# EAGLE design Gloves PCB (EAGLE 6.6.0)
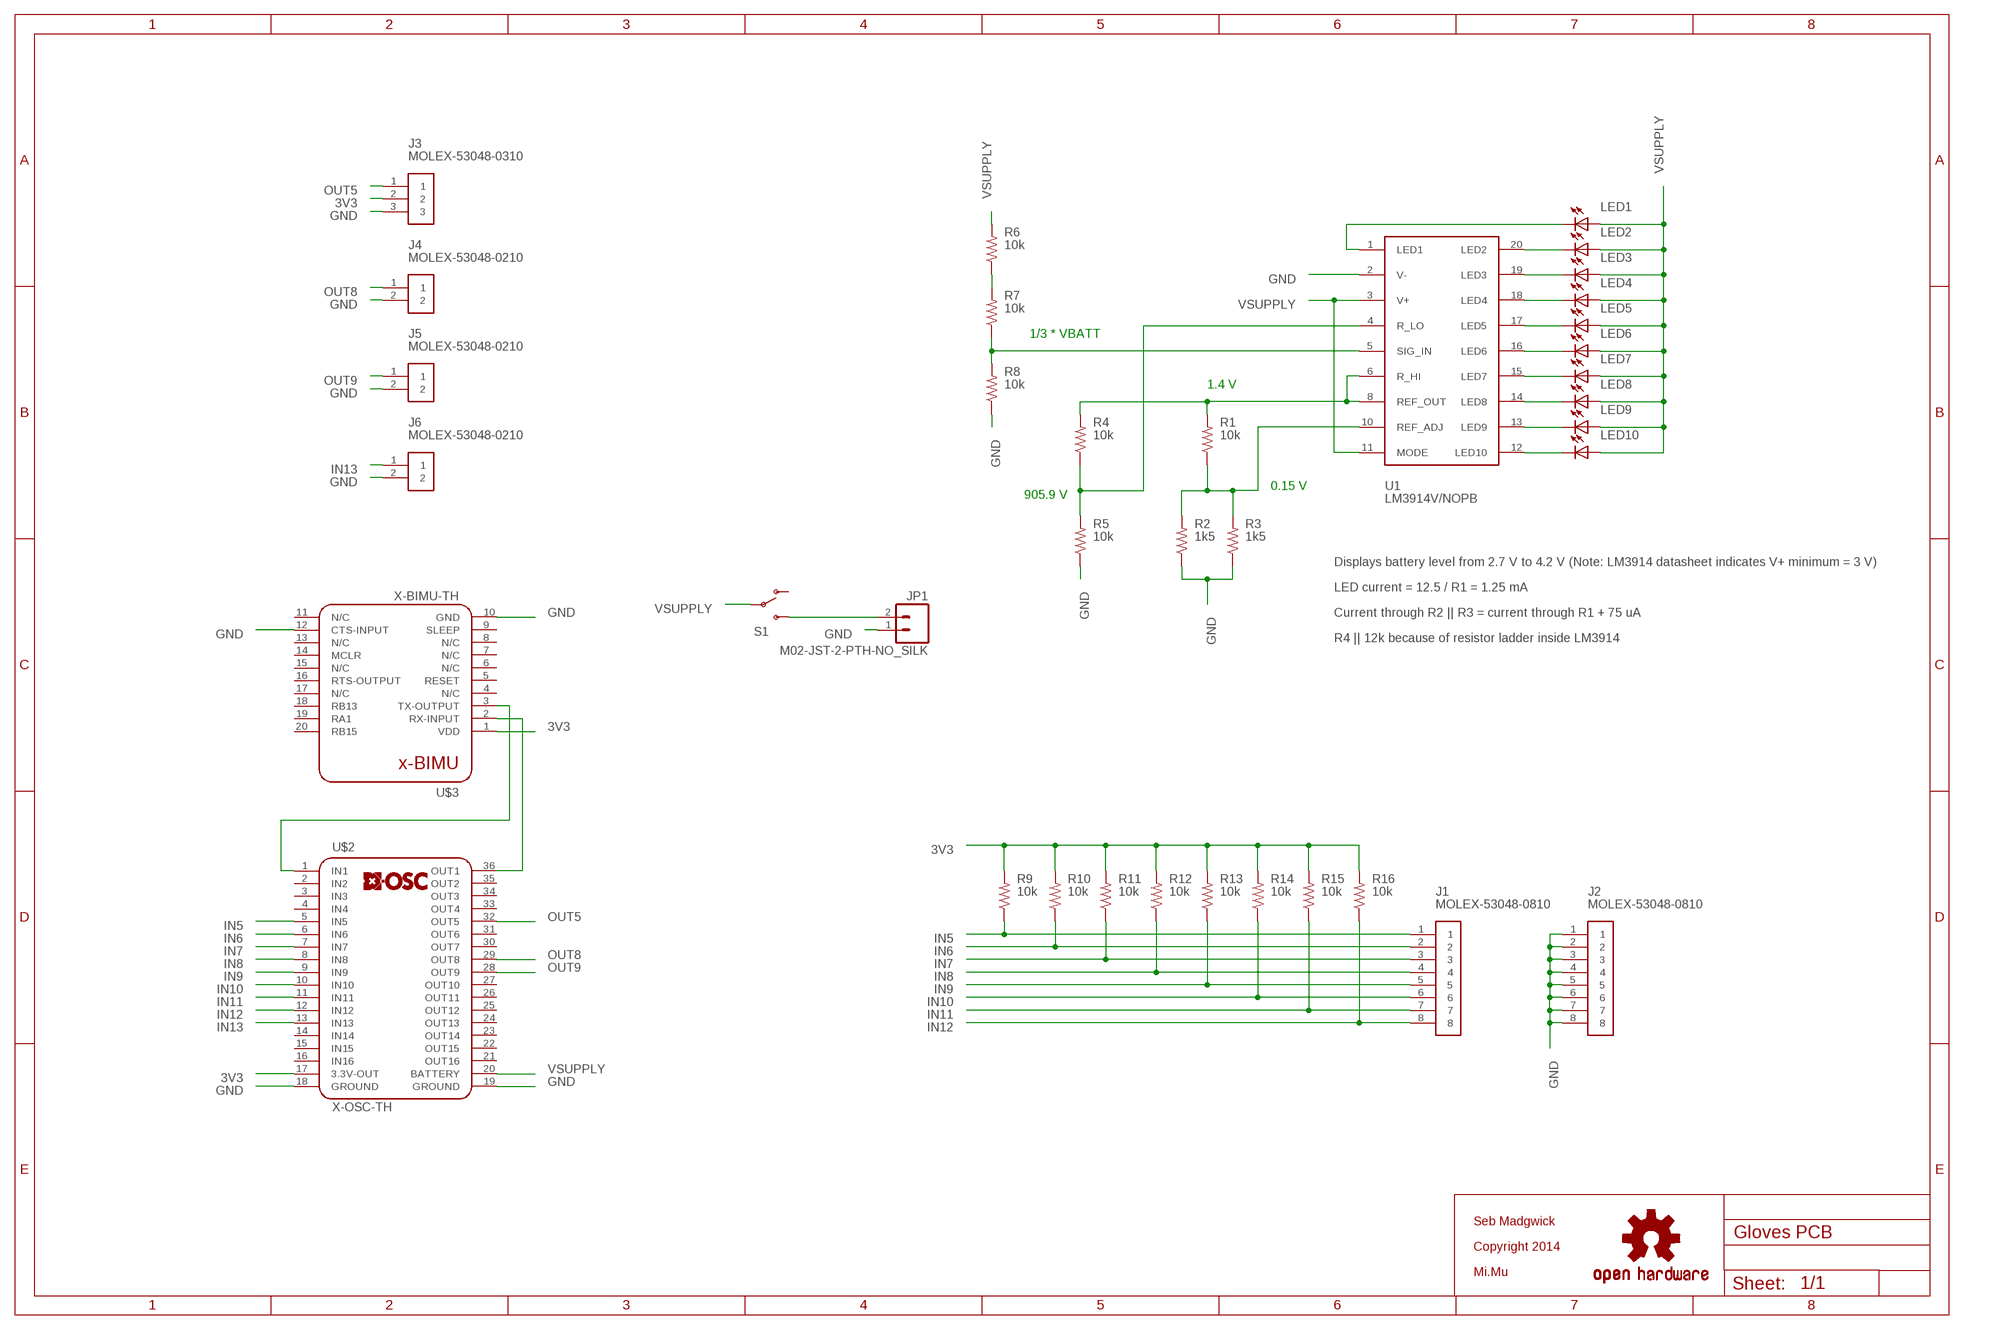
[diagram p0: schematic, sheet 1]

## Parts
J1  MOLEX-53048-0810  [MOLEX-53048-0810]
J2  MOLEX-53048-0810  [MOLEX-53048-0810]
J3  MOLEX-53048-0310  [MOLEX-53048-0310]
J4  MOLEX-53048-0210  [MOLEX-53048-0210]
J5  MOLEX-53048-0210  [MOLEX-53048-0210]
J6  MOLEX-53048-0210  [MOLEX-53048-0210]
JP1  M02-JST-2-PTH-NO_SILK  [JST-2-PTH-NS]
LED1  LEDCHIPLED_1206  [CHIPLED_1206]
LED2  LEDCHIPLED_1206  [CHIPLED_1206]
LED3  LEDCHIPLED_1206  [CHIPLED_1206]
LED4  LEDCHIPLED_1206  [CHIPLED_1206]
LED5  LEDCHIPLED_1206  [CHIPLED_1206]
LED6  LEDCHIPLED_1206  [CHIPLED_1206]
LED7  LEDCHIPLED_1206  [CHIPLED_1206]
LED8  LEDCHIPLED_1206  [CHIPLED_1206]
LED9  LEDCHIPLED_1206  [CHIPLED_1206]
LED10  LEDCHIPLED_1206  [CHIPLED_1206]
R1  10k  RESISTOR0805-RES  [0805]
R2  1k5  RESISTOR0805-RES  [0805]
R3  1k5  RESISTOR0805-RES  [0805]
R4  10k  RESISTOR0805-RES  [0805]
R5  10k  RESISTOR0805-RES  [0805]
R6  10k  RESISTOR0805-RES  [0805]
R7  10k  RESISTOR0805-RES  [0805]
R8  10k  RESISTOR0805-RES  [0805]
R9  10k  RESISTOR0805-RES  [0805]
R10  10k  RESISTOR0805-RES  [0805]
R11  10k  RESISTOR0805-RES  [0805]
R12  10k  RESISTOR0805-RES  [0805]
R13  10k  RESISTOR0805-RES  [0805]
R14  10k  RESISTOR0805-RES  [0805]
R15  10k  RESISTOR0805-RES  [0805]
R16  10k  RESISTOR0805-RES  [0805]
S1  SWITCH-DPST  [WURTH-ELEKTRONIK-450301014042]
U1  LM3914V/NOPB  LM3914PLCC  [PLCC-20]
U$1  OSHW-LOGOS  [OSHW-LOGO-S]
U$2  X-OSC-TH  [X-OSC_TH]
U$3  X-BIMU-TH  [X-BIMU_TH]

## Nets
3V3: J3.2 R9.2 R10.2 R11.2 R12.2 R13.2 R14.2 R15.2 R16.2 U$2.17(3.3V-OUT) U$3.1(VDD)
GND: J2.1 J2.2 J2.3 J2.4 J2.5 J2.6 J2.7 J2.8 J3.3 J4.2 J5.2 J6.2 JP1.1 R2.1 R3.1 R5.1 R8.1 U1.2(V-) U$2.18(GROUND) U$2.19(GROUND) U$3.10(GND) U$3.12(CTS-INPUT)
IN5: J1.1 R9.1 U$2.5(IN5)
IN6: J1.2 R10.1 U$2.6(IN6)
IN7: J1.3 R11.1 U$2.7(IN7)
IN8: J1.4 R12.1 U$2.8(IN8)
IN9: J1.5 R13.1 U$2.9(IN9)
IN10: J1.6 R14.1 U$2.10(IN10)
IN11: J1.7 R15.1 U$2.11(IN11)
IN12: J1.8 R16.1 U$2.12(IN12)
IN13: J6.1 U$2.13(IN13)
N$1: U$2.1(IN1) U$3.3(TX-OUTPUT)
N$2: R4.1 R5.2 U1.4(R_LO)
N$3: JP1.2 S1.3
N$4: R7.1 R8.2 U1.5(SIG_IN)
N$5: R6.1 R7.2
N$6: R1.1 R2.2 R3.2 U1.10(REF_ADJ)
N$7: LED10.C U1.12(LED10)
N$8: LED9.C U1.13(LED9)
N$9: LED8.C U1.14(LED8)
N$10: LED7.C U1.15(LED7)
N$11: LED6.C U1.16(LED6)
N$12: LED5.C U1.17(LED5)
N$13: LED4.C U1.18(LED4)
N$14: LED3.C U1.19(LED3)
N$15: LED2.C U1.20(LED2)
N$16: LED1.C U1.1(LED1)
N$21: U$2.36(OUT1) U$3.2(RX-INPUT)
OUT5: J3.1 U$2.32(OUT5)
OUT8: J4.1 U$2.29(OUT8)
OUT9: J5.1 U$2.28(OUT9)
REF_OUT: R1.2 R4.2 U1.6(R_HI) U1.8(REF_OUT)
VSUPPLY: LED1.A LED2.A LED3.A LED4.A LED5.A LED6.A LED7.A LED8.A LED9.A LED10.A R6.2 S1.2 U1.3(V+) U1.11(MODE) U$2.20(BATTERY)
Unconnected: S1.1 U$2.2(IN2) U$2.3(IN3) U$2.4(IN4) U$2.14(IN14) U$2.15(IN15) U$2.16(IN16) U$2.21(OUT16) U$2.22(OUT15) U$2.23(OUT14) U$2.24(OUT13) U$2.25(OUT12) U$2.26(OUT11) U$2.27(OUT10) U$2.30(OUT7) U$2.31(OUT6) U$2.33(OUT4) U$2.34(OUT3) U$2.35(OUT2) U$3.4(N/C) U$3.5(RESET) U$3.6(N/C) U$3.7(N/C) U$3.8(N/C) U$3.9(SLEEP) U$3.11(N/C) U$3.13(N/C) U$3.14(MCLR) U$3.15(N/C) U$3.16(RTS-OUTPUT) U$3.17(N/C) U$3.18(RB13) U$3.19(RA1) U$3.20(RB15)

## Notes on the sheet
- 1/3 * VBATT
- 1.4 V
- 905.9 V | 0.15 V
- Displays battery level from 2.7 V to 4.2 V (Note: LM3914 datasheet indicates V+ minimum = 3 V)
- LED current = 12.5 / R1 = 1.25 mA
- Current through R2 || R3 = current through R1 + 75 uA
- R4 || 12k because of resistor ladder inside LM3914
- Seb Madgwick
- Copyright 2014
- Mi.Mu

## Library data of the parts
J1 J2 = x-io:MOLEX-53048-0810
J3 = x-io:MOLEX-53048-0310
J4-J6 = x-io:MOLEX-53048-0210
JP1 = SparkFun-Connectors:M02: Standard 2-pin 0.1" header. Use with - straight break away headers ( PRT-00116) - right angle break away headers (PRT-00553) - swiss pins (PRT-00743) - machine pins (PRT-00117) - female headers (PRT-00115) Molex polarized connector foot print use with: PRT-08233 with associated crimp pins and housings. 2.54_SCREWTERM for use with PRT-10571. 3.5mm Screw Terminal footprints for PRT-08084 5mm Screw Terminal footprints for use with PRT-08433
LED1-LED10 = led:LED: LED OSRAM: - CHIPLED LG R971, LG N971, LY N971, LG Q971, LY Q971, LO R971, LY R971 LH N974, LH R974 LS Q976, LO Q976, LY Q976 LO Q996 - Hyper CHIPLED LW Q18S LB Q993, LB Q99A, LB R99A - SideLED LS A670, LO A670, LY A670, LG A670, LP A670 LB A673, LV A673, LT A673, LW A673 LH A674 LY A675 LS A676, LA A676, LO A676, LY A676, LW A676 LS A679, LY A679, LG A679 - Hyper Micro SIDELED® LS Y876, LA Y876, LO Y876, LY Y876 LT Y87S - SmartLED LW L88C, LW L88S LB L89C, LB L89S, LG L890 LS L89K, LO L89K, LY L89K LS L896, LA L896, LO L896, LY L896 - TOPLED LS T670, LO T670, LY T670, LG T670, LP T670 LSG T670, LSP T670, LSY T670, LOP T670, LYG T670 LG T671, LOG T671, LSG T671 LB T673, LV T673, LT T673, LW T673 LH T674 LS T676, LA T676, LO T676, LY T676, LB T676, LH T676, LSB T676, LW T676 LB T67C, LV T67C, LT T67C, LS T67K, LO T67K, LY T67K, LW E67C LS E67B, LA E67B, LO E67B, LY E67B, LB E67C, LV E67C, LT E67C LW T67C LS T679, LY T679, LG T679 LS T770, LO T770, LY T770, LG T770, LP T770 LB T773, LV T773, LT T773, LW T773 LH T774 LS E675, LA E675, LY E675, LS T675 LS T776, LA T776, LO T776, LY T776, LB T776 LHGB T686 LT T68C, LB T68C - Hyper Mini TOPLED® LB M676 - Mini TOPLED Santana® LG M470 LS M47K, LO M47K, LY M47K Source: http://www.osram.convergy.de - LUMILED® LXK2-PW12-R00, LXK2-PW12-S00, LXK2-PW14-U00, LXK2-PW14-V00 LXK2-PM12-R00, LXK2-PM12-S00, LXK2-PM14-U00 LXK2-PE12-Q00, LXK2-PE12-R00, LXK2-PE12-S00, LXK2-PE14-T00, LXK2-PE14-U00 LXK2-PB12-K00, LXK2-PB12-L00, LXK2-PB12-M00, LXK2-PB14-N00, LXK2-PB14-P00, LXK2-PB14-Q00 LXK2-PR12-L00, LXK2-PR12-M00, LXK2-PR14-Q00, LXK2-PR14-R00 LXK2-PD12-Q00, LXK2-PD12-R00, LXK2-PD12-S00 LXK2-PH12-R00, LXK2-PH12-S00 LXK2-PL12-P00, LXK2-PL12-Q00, LXK2-PL12-R00 Source: www.luxeon.com
R1-R16 = SparkFun-Passives:RESISTOR: Resistor Basic schematic elements and footprints for 0603, 1206, and PTH resistors.
S1 = x-io:SWITCH-DPST: SPST Switch Simple slide switch. Spark Fun Electronics SKU : COM-00102
U1 = x-io:LM3914
U$1 = SparkFun_08_2011:OSHW-LOGO: Open Source Hardware Logo This logo indicates the piece of hardware it is found on incorporates a OSHW license and/or adheres to the definition of open source hardware found here: http://freedomdefined.org/OSHW
U$2 = x-io-EAGLE-Library:X-OSC: x-OSC <http://www.x-io.co.uk/products/x-osc/> foot print for SMD or through-hole headers.
U$3 = x-io-EAGLE-Library:X-BIMU: x-BIMU <http://www.x-io.co.uk/products/x-bimu/> foot print for SMD or through-hole headers.

## Board
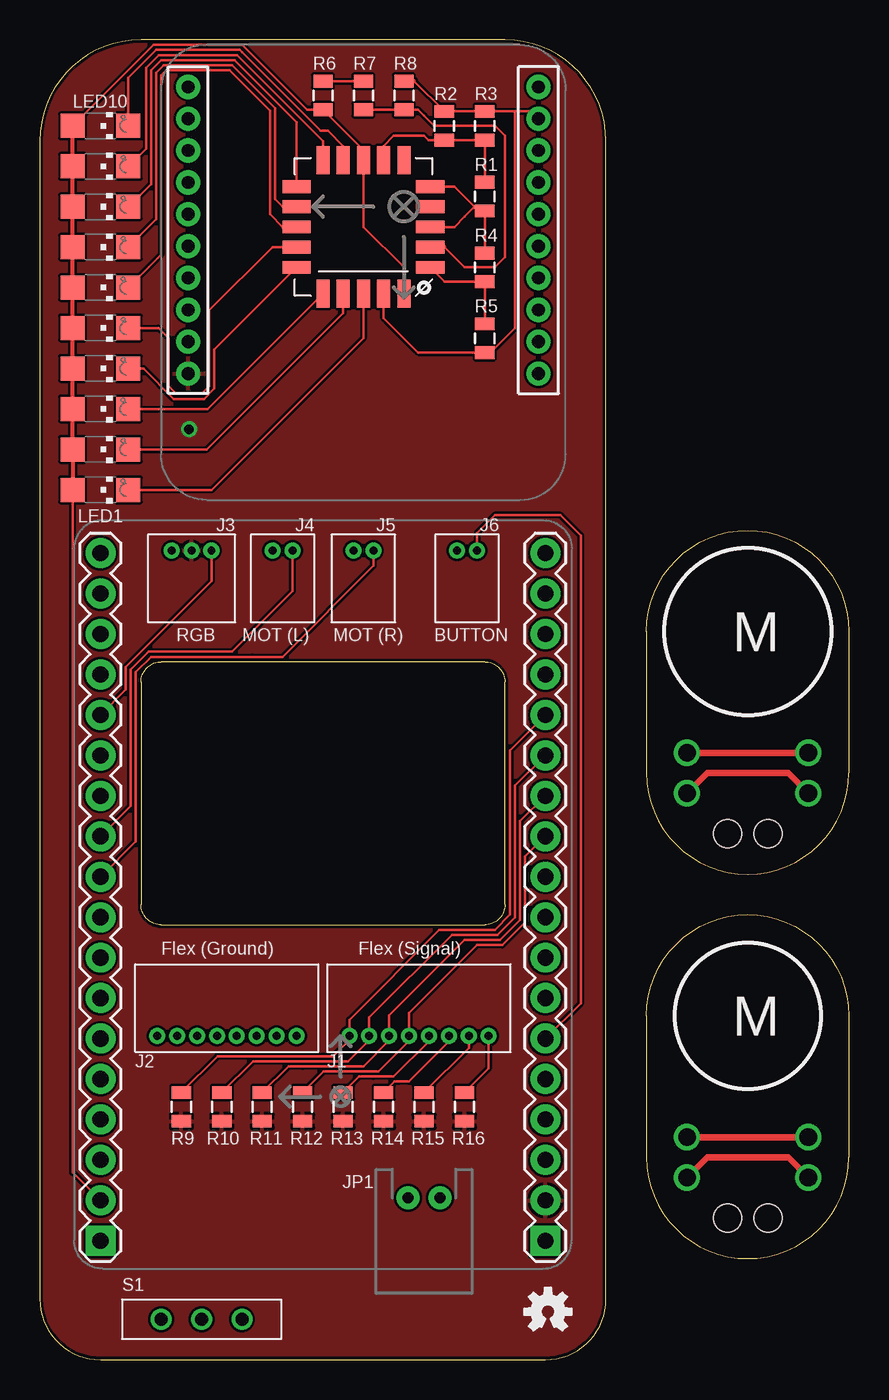
[diagram p1: board, top side]
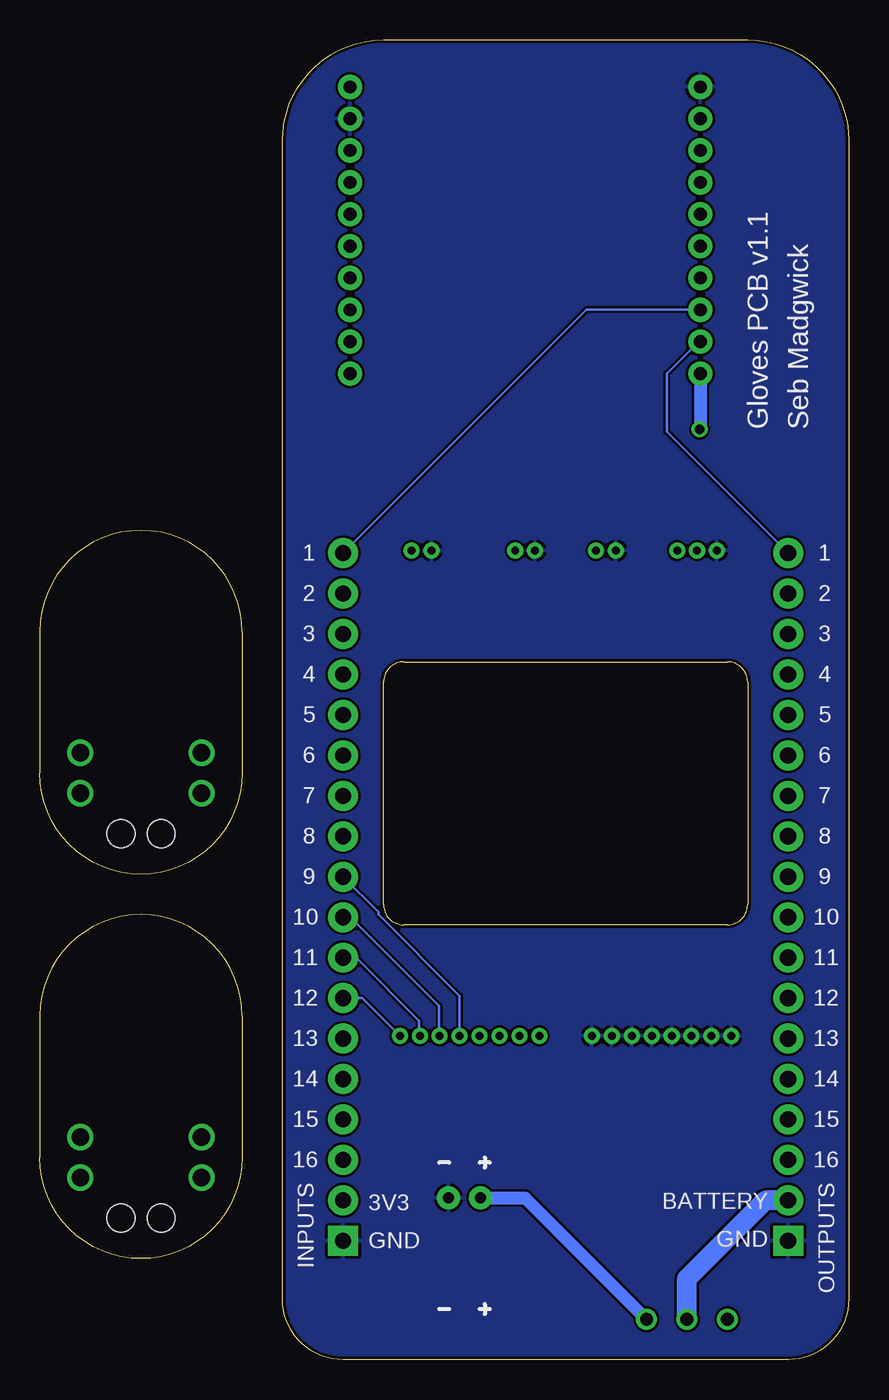
[diagram p2: board, bottom side, seen from below]

Size 50.8 x 82.87 mm. Coordinates in mm from the lower left corner, seen from the top.
Outline: 3.81,0 31.75,0 arc90 35.56,3.81 35.56,76.52 arc90 29.21,82.87 6.35,82.87 arc90 0,76.52 0,3.81 arc90 3.81,0
Outline: 7.62,27.3 27.94,27.3 arc90 29.21,28.57 29.21,42.55 arc90 27.94,43.81 7.62,43.81 arc90 6.35,42.55 6.35,28.57 arc90 7.62,27.3
Outline: 38.1,45.72 arc-180 50.8,45.72 50.8,36.83 arc-180 38.1,36.83 38.1,45.72
Outline: 38.1,21.59 arc-180 50.8,21.59 50.8,12.7 arc-180 38.1,12.7 38.1,21.59
Copper layers (1*16): Top 0.035mm / dielectric 1.5mm / Bottom 0.035mm
Design rules "default *": minimum track width 0.15mm, minimum drill 0.3mm, track to track 0.15mm, track to pad 0.15mm, pad to pad 0.15mm, via to via 0.15mm, smd to smd 0.15mm, copper to edge 0.2mm, drill to drill 0.15mm, minimum pad ring 10mil, minimum via ring 8mil, stop-mask expansion 4mil, vias tented up to drill 1mm, thermal gap 0.195mm
Holes 1.75 mm at 45.72,33.02 43.18,33.02 45.72,8.89 43.18,8.89

### Footprints (pad centres in the part's own frame; a part is rotated, then mirrored left to right if it is on the bottom)
MOLEX-53048-0810 = drill 0.5: 1 -4.375,0; 2 -3.125,0; 3 -1.875,0; 4 -0.625,0; 5 0.625,0; 6 1.875,0; 7 3.125,0; 8 4.375,0
MOLEX-53048-0310 = drill 0.5: 1 -1.25,0; 2 0,0; 3 1.25,0
MOLEX-53048-0210 = drill 0.5: 1 -0.625,0; 2 0.625,0
JST-2-PTH-NS = drill 0.7 pad 1.448: 1 -1,0; 2 1,0
CHIPLED_1206 = smd 1.5 x 1.5: A 0,-1.75; C 0,1.75
0805 = smd 0.8 x 1.2: 1 -0.9,0; 2 0.9,0
WURTH-ELEKTRONIK-450301014042 = drill 0.8: 1 -2.54,0; 2 0,0; 3 2.54,0
PLCC-20 = smd 0.813 x 1.778: 1 0,4.191; 2 -1.27,4.191; 3 -2.54,4.191; 9 -2.54,-4.191; 10 -1.27,-4.191; 11 0,-4.191; 12 1.27,-4.191; 13 2.54,-4.191; 19 2.54,4.191; 20 1.27,4.191 | smd 1.778 x 0.813: 4 -4.191,2.54; 5 -4.191,1.27; 6 -4.191,0; 7 -4.191,-1.27; 8 -4.191,-2.54; 14 4.191,-2.54; 15 4.191,-1.27; 16 4.191,0; 17 4.191,1.27; 18 4.191,2.54
X-OSC_TH = drill 1.016 pad 1.88: 1 13.97,21.431; 2 13.97,18.891; 3 13.97,16.351; 4 13.97,13.811; 5 13.97,11.271; 6 13.97,8.731; 7 13.97,6.191; 8 13.97,3.651; 9 13.97,1.111; 10 13.97,-1.429; 11 13.97,-3.969; 12 13.97,-6.509; 13 13.97,-9.049; 14 13.97,-11.589; 15 13.97,-14.129; 16 13.97,-16.669; 17 13.97,-19.209; 20 -13.97,-19.209; 21 -13.97,-16.669; 22 -13.97,-14.129; 23 -13.97,-11.589; 24 -13.97,-9.049; 25 -13.97,-6.509; 26 -13.97,-3.969; 27 -13.97,-1.429; 28 -13.97,1.111; 29 -13.97,3.651; 30 -13.97,6.191; 31 -13.97,8.731; 32 -13.97,11.271; 33 -13.97,13.811; 34 -13.97,16.351; 35 -13.97,18.891; 36 -13.97,21.431 | drill 1.016 pad 1.88 square: 18 13.97,-21.749; 19 -13.97,-21.749
X-BIMU_TH = drill 0.8 pad 1.524: 1 11,7.935; 2 11,5.935; 3 11,3.935; 4 11,1.935; 5 11,-0.065; 6 11,-2.065; 7 11,-4.065; 8 11,-6.065; 9 11,-8.065; 10 11,-10.065; 11 -11,-10.065; 12 -11,-8.065; 13 -11,-6.065; 14 -11,-4.065; 15 -11,-2.065; 16 -11,-0.065; 17 -11,1.935; 18 -11,3.935; 19 -11,5.935; 20 -11,7.935

### Placement (x,y rotation side)
J1  23.81,20.32 0 top
J2  11.75,20.32 0 top
J3  9.53,50.8 180 top
J4  15.24,50.8 180 top
J5  20.32,50.8 180 top
J6  26.83,50.8 180 top
JP1  24.13,10.16 180 top
LED1  3.81,54.61 270 top
LED2  3.81,57.15 270 top
LED3  3.81,59.69 270 top
LED4  3.81,62.23 270 top
LED5  3.81,64.77 270 top
LED6  3.81,67.31 270 top
LED7  3.81,69.85 270 top
LED8  3.81,72.39 270 top
LED9  3.81,74.93 270 top
LED10  3.81,77.47 270 top
R1  27.94,73.03 270 top
R2  25.4,77.47 270 top
R3  27.94,77.47 270 top
R4  27.94,68.58 90 top
R5  27.94,64.14 90 top
R6  17.78,79.38 270 top
R7  20.32,79.38 90 top
R8  22.86,79.38 270 top
R9  8.89,15.88 270 top
R10  11.43,15.88 270 top
R11  13.97,15.88 270 top
R12  16.51,15.88 270 top
R13  19.05,15.88 270 top
R14  21.59,15.88 270 top
R15  24.13,15.88 270 top
R16  26.67,15.88 270 top
S1  10.16,2.54 0 top
U1  20.32,71.12 180 top
U$1  31.91,3.02 0 top
U$2  17.78,29.21 0 top
U$3  20.32,69.85 180 top

### Tracks (layer width: path | path; a pad name or v marks a point on that pad's centre or on a via)
3V3  (via drill 0.6)
  Bottom 0.813: U$3.1 9.32,58.47 v9.37,58.42
  pour Top: 0,82.87 35.56,82.87 35.56,0 0,0
GND
  Top 0.152: U1.2 21.59,65.41 23.76,63.23 R5.1 28.31,63.23 29.84,64.77 29.84,78.37 | 23.5,80.28 R2.1 R3.1 29.84,78.37 | 29.84,78.37 30.86,78.37 U$3.12
  Top 0.254: R8.1 23.5,80.28
  pour Bottom: 0,82.87 35.56,82.87 35.56,0 0,0
IN5
  Top 0.152: U$2.5 29.53,38.26 29.53,28.26 29.53,28.1 29.53,27.94 28.57,26.99 25.08,26.99 19.44,21.34 J1.1 19.44,20.07 18.41,19.05 12.06,19.05 11.16,19.05 R9.1
IN6
  Top 0.152: U$2.6 29.84,36.04 29.84,27.94 29.84,27.78 28.73,26.67 25.88,26.67 20.69,21.48 J1.2 20.69,20.05 19.37,18.73 14.29,18.73 13.39,18.73 R10.1
IN7
  Top 0.152: U$2.7 30.16,33.81 30.16,27.62 28.89,26.35 26.67,26.35 21.94,21.62 J1.3 21.94,20.03 20.32,18.41 16.51,18.41 15.61,18.41 R11.1
IN8
  Top 0.152: U$2.8 30.48,31.59 30.48,27.46 29.05,26.04 27.46,26.04 23.19,21.76 J1.4 23.19,20.01 21.27,18.1 18.73,18.1 17.83,18.1 R12.1
IN9
  Top 0.152: J1.5 24.44,19.99 22.23,17.78 20.95,17.78 20.05,17.78 R13.1
  Bottom 0.152: U$2.9 29.53,28.1 29.53,27.94 24.44,22.85 J1.5
IN10
  Top 0.152: J1.6 25.69,19.97 23.18,17.46 22.54,17.46 22.28,17.46 R14.1
  Bottom 0.152: U$2.10 31.27,27.78 25.72,22.23 25.72,20.35 J1.6
IN11
  Top 0.152: J1.7 26.94,19.58 R15.1
  Bottom 0.152: U$2.11 30.96,25.24 26.99,21.27 26.99,20.37 J1.7
IN12
  Top 0.152: J1.8 28.19,18.29 R16.1
  Bottom 0.152: U$2.12 30.57,22.7 J1.8
IN13
  Top 0.152: U$2.13 33.97,22.38 33.97,51.75 32.7,53.02 28.57,53.02 27.45,51.9 J6.1
L_MOT_N  (via drill 1.1)
  Top 0.406: v40.64,35.56 41.91,36.83 46.99,36.83 v48.26,35.56
L_MOT_N1  (via drill 1.1)
  Top 0.406: v40.64,11.43 41.91,12.7 46.99,12.7 v48.26,11.43
L_MOT_P  (via drill 1.1)
  Top 0.406: v40.64,38.1 v48.26,38.1
L_MOT_P1  (via drill 1.1)
  Top 0.406: v40.64,13.97 v48.26,13.97
N$1
  Bottom 0.152: U$3.3 16.48,65.92 U$2.1
N$2
  Top 0.152: R5.2 R4.1 25.41,67.68 U1.4
N$3
  Bottom 0.813: JP1.2 20.32,10.16 S1.3
N$4
  Top 0.152: R7.1 R8.2 23.76,78.47 24.13,78.11 24.77,77.47 28.57,77.47 29.21,76.83 29.21,69.22 28.57,68.58 26.67,68.58 25.4,69.85
  Top 0.254: U1.5 25.4,69.85
N$5
  Top 0.152: R6.1 R7.2
N$6
  Top 0.152: R1.1 R3.2 R2.2 24.39,76.57 24.13,76.83 22.23,76.83 21.59,76.2 U1.10
N$7
  Top 0.152: U1.12 19.05,76.2 18.1,77.15 17.62,77.15 12.7,82.07 12.54,82.23 7.3,82.23 5.56,80.49 LED10.C
N$8
  Top 0.152: U1.13 17.78,76.52 12.38,81.92 7.46,81.92 6.67,81.12 6.67,76.04 LED9.C
N$9
  Top 0.152: U1.14 16.13,77.69 12.22,81.6 7.62,81.6 6.99,80.96 6.99,73.81 LED8.C
N$10
  Top 0.152: U1.15 15.24,72.39 14.76,72.87 14.76,78.58 12.06,81.28 7.78,81.28 7.3,80.8 7.3,71.59 LED7.C
N$11
  Top 0.152: U1.16 15.24,71.12 14.45,71.91 14.45,78.42 11.91,80.96 7.94,80.96 7.62,80.64 7.62,69.37 LED6.C
N$12
  Top 0.152: LED5.C 7.46,64.77 8.1,64.14 8.1,61.12 8.57,60.64 10.16,60.64 10.64,61.12 10.64,65.88 14.61,69.85 U1.17
N$13
  Top 0.152: LED4.C 6.51,62.23 8.41,60.33 10.32,60.33 10.95,60.96 10.95,63.41 U1.18
N$14
  Top 0.152: LED3.C 10.54,59.69 U1.19
N$15
  Top 0.152: LED2.C 10.48,57.15 19.05,65.72 U1.20
N$16
  Top 0.152: U1.1 20.32,64.14 10.79,54.61 LED1.C
N$21
  Bottom 0.152: U$2.36 11.43,58.26 11.43,61.91 9.43,63.91 U$3.2
OUT5
  Top 0.152: U$2.32 5.4,42.07 5.4,43.5 10.78,48.88 J3.1
OUT8
  Top 0.152: U$2.29 5.71,34.77 5.71,43.34 6.83,44.45 12.06,44.45 15.87,48.25 J4.1
OUT9
  Top 0.152: U$2.28 6.03,32.54 6.03,43.18 6.99,44.13 13.34,44.13 15.24,44.13 20.95,49.85 J5.1
REF_OUT
  Top 0.152: R4.2 R1.2 | U1.8 26.04,73.66 27.3,72.39 26.67,71.75 26.04,71.12 U1.6
  Top 0.254: R1.2 27.57,72.12 27.3,72.39
VSUPPLY
  Top 0.152: U1.3 22.86,68.58 20.32,71.12 U1.11 | 20.32,75.94 R6.2 16.77,78.47 12.7,82.55 7.14,82.55 LED10.A | U$2.20 2.06,11.75 LED1.A
  Top 0.254: U1.11 20.32,75.94 | LED9.A LED8.A LED7.A LED6.A LED5.A LED4.A LED3.A LED2.A LED1.A | LED9.A 2.06,75.09 1.59,75.56 2.22,75.56 2.54,75.25 2.38,75.25 LED9.A | LED9.A LED10.A
  Bottom 1.27: U$2.20 5.24,10 10.16,5.08 S1.2

### Text on the board
_tsilk: RGB | MOT (L) | MOT (R) | BUTTON | M | Flex (Ground) | Flex (Signal) | M
_bsilk: Seb Madgwick | Gloves PCB v1.1 | 1 | 1 | 2 | 2 | 3 | 3 | 4 | 4 | 5 | 5 | 6 | 6 | 7 | 7 | 8 | 8 | 9 | 9 | 10 | 10 | 11 | 11 | 12 | 12 | 13 | 13 | 14 | 14 | 15 | 15 | 16 | 16 | OUTPUTS | INPUTS | BATTERY | 3V3 | GND | GND